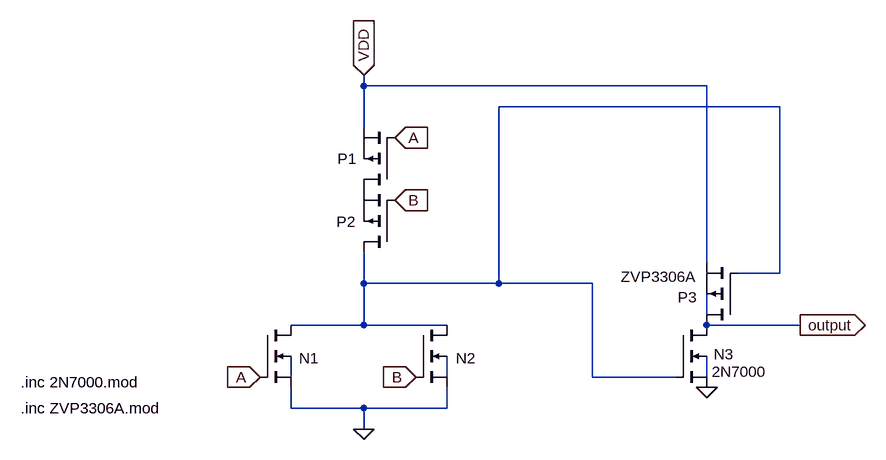
[diagram p0: schematic AND.asc]
AND.asc, the LTspice schematic file:
Version 4.1
SHEET 1 880 680
WIRE -48 -112 -48 -128
WIRE 480 -112 -48 -112
WIRE 592 -80 160 -80
WIRE -48 -48 -48 -112
WIRE 480 160 480 -112
WIRE 592 176 592 -80
WIRE 592 176 528 176
WIRE -48 192 -48 144
WIRE 160 192 160 -80
WIRE 160 192 -48 192
WIRE 304 192 160 192
WIRE 480 240 480 208
WIRE -48 256 -48 192
WIRE -48 256 -160 256
WIRE 80 256 -48 256
WIRE 624 256 480 256
WIRE -160 336 -160 304
WIRE 80 336 80 304
WIRE 304 336 304 192
WIRE 432 336 304 336
WIRE 480 336 480 304
WIRE -160 384 -160 352
WIRE -48 384 -160 384
WIRE 80 384 80 352
WIRE 80 384 -48 384
WIRE -48 416 -48 384
FLAG -48 416 0
FLAG -48 -128 VDD
IOPIN -48 -128 In
FLAG 0 -32 A
IOPIN 0 -32 In
FLAG -208 336 A
IOPIN -208 336 In
FLAG 0 64 B
IOPIN 0 64 In
FLAG 32 336 B
IOPIN 32 336 In
FLAG 480 352 0
FLAG 624 256 output
IOPIN 624 256 Out
SYMBOL nmos4 -208 256 R0
WINDOW 0 60 51 Left 2
WINDOW 3 56 72 Invisible 2
SYMATTR InstName N1
SYMATTR Value 2N7000
SYMATTR Prefix X
SYMBOL pmos 0 48 R180
WINDOW 0 59 48 Left 2
WINDOW 3 56 72 Invisible 2
SYMATTR InstName P1
SYMATTR Value ZVP3306A
SYMATTR Prefix X
SYMBOL nmos4 32 256 R0
WINDOW 0 62 51 Left 2
WINDOW 3 56 72 Invisible 2
SYMATTR InstName N2
SYMATTR Value 2N7000
SYMATTR Prefix X
SYMBOL pmos 0 144 R180
WINDOW 0 61 47 Left 2
WINDOW 3 56 72 Invisible 2
SYMATTR InstName P2
SYMATTR Value ZVP3306A
SYMATTR Prefix X
SYMBOL nmos4 432 256 R0
WINDOW 0 59 45 Left 2
SYMATTR InstName N3
SYMATTR Value 2N7000
SYMATTR Prefix X
SYMBOL pmos 528 256 R180
WINDOW 0 63 43 Left 2
WINDOW 3 64 74 Left 2
SYMATTR InstName P3
SYMATTR Value ZVP3306A
SYMATTR Prefix X
TEXT -576 344 Left 2 !.inc 2N7000.mod
TEXT -576 384 Left 2 !.inc ZVP3306A.mod

The netlist it stands for:
* AND.asc
X§N1 N001 A 0 N003 2N7000  ; pins D G S B
X§P1 P001 A VDD ZVP3306A  ; pins D G S
X§N2 N001 B 0 N004 2N7000  ; pins D G S B
X§P2 N001 B P001 ZVP3306A  ; pins D G S
X§N3 output N001 0 N005 2N7000  ; pins D G S B
X§P3 output N001 VDD ZVP3306A  ; pins D G S
.inc 2N7000.mod
.inc ZVP3306A.mod
.backanno
.end